# EAGLE design slimsata (EAGLE 6.4)
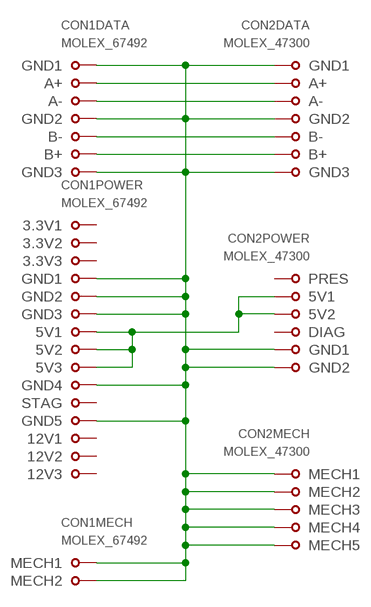
[diagram p0: schematic, sheet 1]

## Parts
CON1  MOLEX_67492  [MOLEX_67492]
CON2  MOLEX_47300  MOLEX_47300_KOMBI  [MOLEX_47300-100X/101X/102X/103X]

## Nets
A_N [data]: CON1.S3(DATA:A-) CON2.S3(DATA:A-)
A_P [data]: CON1.S2(DATA:A+) CON2.S2(DATA:A+)
B_N [data]: CON1.S5(DATA:B-) CON2.S5(DATA:B-)
B_P [data]: CON1.S6(DATA:B+) CON2.S6(DATA:B+)
GND [gnd]: CON1.MECH1(MECH:MECH1) CON1.MECH2(MECH:MECH2) CON1.P4(POWER:GND1) CON1.P5(POWER:GND2) CON1.P6(POWER:GND3) CON1.P10(POWER:GND4) CON1.P12(POWER:GND5) CON1.S1(DATA:GND1) CON1.S4(DATA:GND2) CON1.S7(DATA:GND3) CON2.MECH1(MECH:MECH1) CON2.MECH2(MECH:MECH2) CON2.MECH3(MECH:MECH3) CON2.MECH4(MECH:MECH4) CON2.MECH5(MECH:MECH5) CON2.P5(POWER:GND1) CON2.P6(POWER:GND2) CON2.S1(DATA:GND1) CON2.S4(DATA:GND2) CON2.S7(DATA:GND3)
N$3: CON1.P7(POWER:5V1) CON1.P8(POWER:5V2) CON1.P9(POWER:5V3) CON2.P2(POWER:5V1) CON2.P3(POWER:5V2)
Unconnected: CON1.P1(POWER:3.3V1) CON1.P2(POWER:3.3V2) CON1.P3(POWER:3.3V3) CON1.P11(POWER:STAG) CON1.P13(POWER:12V1) CON1.P14(POWER:12V2) CON1.P15(POWER:12V3) CON2.P1(POWER:PRES) CON2.P4(POWER:DIAG)

## Library data of the parts
CON1 = sata:MOLEX_67492
CON2 = sata:MOLEX_47300_KOMBI

## Net classes
1 data: width 0.864 mm, clearance 0.508 mm to class 0
2 gnd: clearance 0.254 mm to class 0, clearance 0.508 mm to class 1

## Board
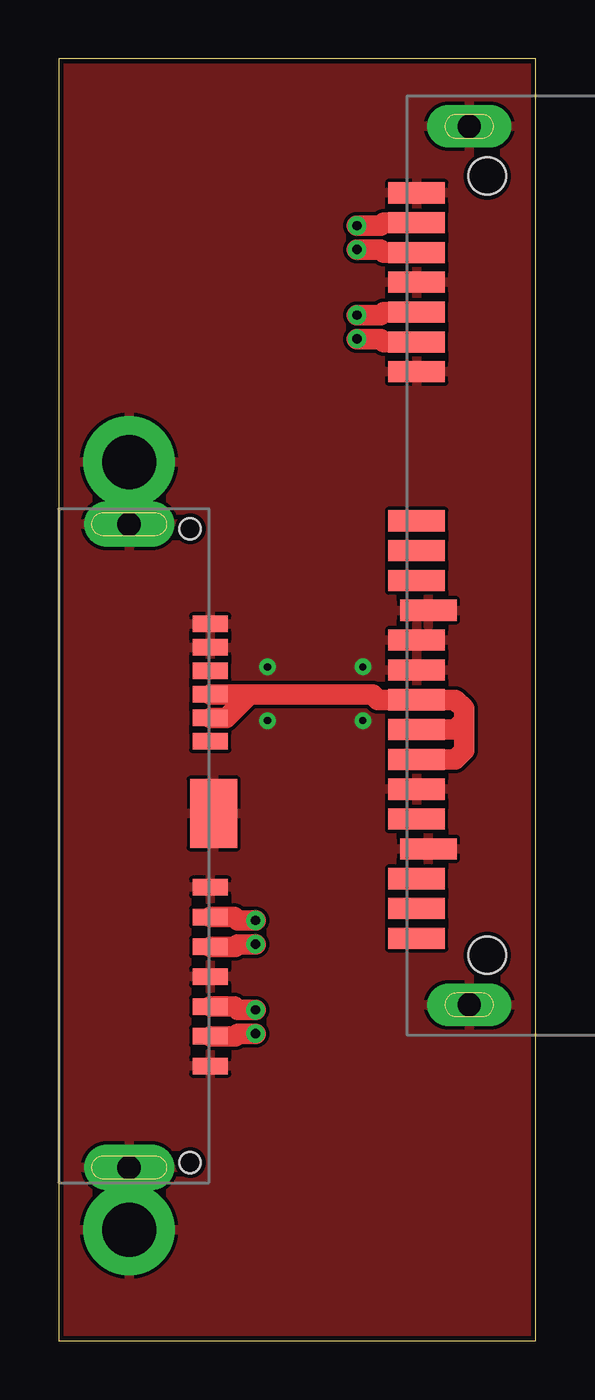
[diagram p1: board, top side]
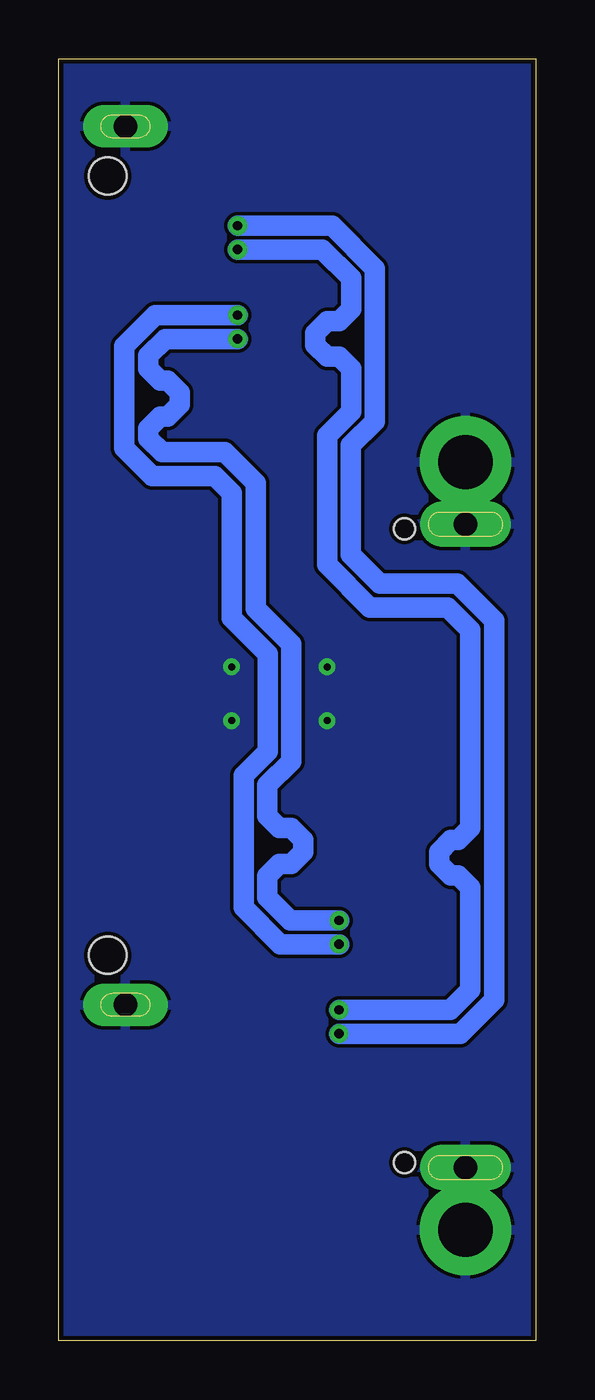
[diagram p2: board, bottom side, seen from below]

Size 20.32 x 54.61 mm. Coordinates in mm from the lower left corner, seen from the top.
Outline: 0,0 20.32,0 20.32,54.61 0,54.6 0,0
Copper layers (1*16): Top 0.035mm / dielectric 1.5mm / Bottom 0.035mm
Design rules "platinensammler_02_mod": minimum track width 0.15mm, minimum drill 0.3mm, track to track 0.15mm, track to pad 0.15mm, pad to pad 0.15mm, via to via 0.15mm, smd to smd 0mil, copper to edge 0.2mm, drill to drill 0.2mm, minimum pad ring 0.2mm, minimum via ring 0.2mm, stop-mask expansion 4mil, vias tented up to drill 0.8mm, thermal gap 0.15mm

### Footprints (pad centres in the part's own frame; a part is rotated, then mirrored left to right if it is on the bottom)
MOLEX_67492 = drill 1 pad 1.8 long: MECH1 -18.71,2.84; MECH2 18.71,2.84 | smd 0.9 x 2.4: P1 1.905,5.08; P2 0.635,5.08; P3 -0.635,5.08; P4 -1.905,4.58; P5 -3.175,5.08; P6 -4.445,5.08; P7 -5.715,5.08; P8 -6.985,5.08; P9 -8.255,5.08; P10 -9.525,5.08; P11 -10.795,5.08; P12 -12.065,4.58; P13 -13.335,5.08; P14 -14.605,5.08; P15 -15.875,5.08; S1 15.875,5.08; S2 14.605,5.08; S3 13.335,5.08; S4 12.065,5.08; S5 10.795,5.08; S6 9.525,5.08; S7 8.255,5.08 | hole 1.6: 16.595,2.08; -16.595,2.08
MOLEX_47300-100X/101X/102X/103X = drill 2.3 pad 3.9: MECH1 -16.35,3; MECH2 16.35,3 | smd 2.93 x 2: MECH3 -1.38,6.6 | drill 1 pad 1.93 long: MECH4 13.7,3; MECH5 -13.7,3 | smd 0.7 x 1.5: P1 -4.45,6.45; P2 -5.45,6.45; P3 -6.45,6.45; P4 -7.45,6.45; P5 -8.45,6.45; P6 -9.45,6.45; S1 9.38,6.45; S2 8.11,6.45; S3 6.84,6.45; S4 5.57,6.45; S5 4.3,6.45; S6 3.03,6.45; S7 1.76,6.45 | hole 0.9: -13.5,5.6; 13.5,5.6

### Placement (x,y rotation side)
CON1  20.32,33.02 90 top
CON2  0,21.08 270 top

### Tracks (layer width: path | path; a pad name or v marks a point on that pad's centre or on a via)
A_N  (via drill 0.4)
  Top 0.864: CON1.S3 13.84,46.35 13.72,46.48 v12.7,46.48 | CON2.S3 7.47,14.24 7.62,14.1 v8.38,14.1
  Bottom 0.864: v12.7,46.48 9.1,46.48 7.87,45.26 7.87,43.94 8.38,43.43 8.89,43.43 9.4,42.93 9.4,42.42 8.89,41.91 8.38,41.91 7.87,41.4 7.87,39.58 8.89,38.56 8.89,33.06 7.07,31.24 3.77,31.24 2.79,30.27 2.79,21.84 3.3,21.34 3.62,21.34 4.13,20.83 4.13,20.32 3.62,19.81 3.3,19.81 2.79,19.3 2.79,14.94 3.64,14.1 v8.38,14.1
A_P  (via drill 0.4)
  Top 0.864: CON1.S2 13.84,47.62 13.72,47.5 v12.7,47.5 | CON2.S2 7.51,12.97 7.62,13.08 v8.38,13.08
  Bottom 0.864: v12.7,47.5 8.68,47.5 6.86,45.68 6.86,39.16 7.88,38.14 7.88,33.48 6.65,32.26 3.35,32.26 1.78,30.69 1.78,14.52 3.22,13.08 v8.38,13.08
B_N  (via drill 0.4)
  Top 0.864: CON1.S5 13.84,43.81 13.72,43.69 v12.7,43.69 | CON2.S5 7.51,16.78 7.62,16.89 v8.38,16.89
  Bottom 0.864: v12.7,43.69 16.21,43.69 17.52,42.37 17.52,38.02 16.34,36.83 13.67,36.83 12.95,36.11 12.95,30.78 11.43,29.25 11.43,25.1 12.45,24.09 12.45,18.46 10.88,16.89 v8.38,16.89
B_P  (via drill 0.4)
  Top 0.864: CON1.S6 13.84,42.55 13.72,42.67 v12.7,42.67 | CON2.S6 7.47,18.05 7.62,17.91 v8.38,17.91
  Bottom 0.864: v12.7,42.67 15.79,42.67 16.51,41.95 16.51,41.4 16,40.89 15.68,40.89 15.18,40.39 15.18,39.88 15.68,39.37 16,39.37 16.51,38.86 16.51,38.44 15.92,37.84 13.25,37.84 11.94,36.53 11.94,31.2 10.41,29.67 10.41,24.68 11.43,23.67 11.43,22.35 10.92,21.84 10.41,21.84 9.91,21.34 9.91,20.83 10.41,20.32 10.92,20.32 11.43,19.81 11.43,18.88 10.46,17.91 v8.38,17.91
GND  (via drill 0.3)
  other vias: 8.89,28.7 8.89,26.42 12.95,28.7 12.95,26.42
  pour Top: 0.25,54.36 20.07,54.36 20.07,0.25 0.25,0.25
  pour Bottom: 0.25,54.36 20.07,54.36 20.07,0.25 0.25,0.25
N$3
  Top 0.864: CON1.P9 16.89,24.77 17.27,25.15 17.27,26.42 | 17.27,26.42 17.27,26.92 16.89,27.3 CON1.P7 13.59,27.3 13.36,27.53 8.13,27.53 | CON1.P8 16.89,26.04 17.27,26.42 | CON2.P3 8.13,27.53 | CON2.P2 7.13,26.53 8.13,27.53